# EAGLE design Serinette (EAGLE 9.5.2)
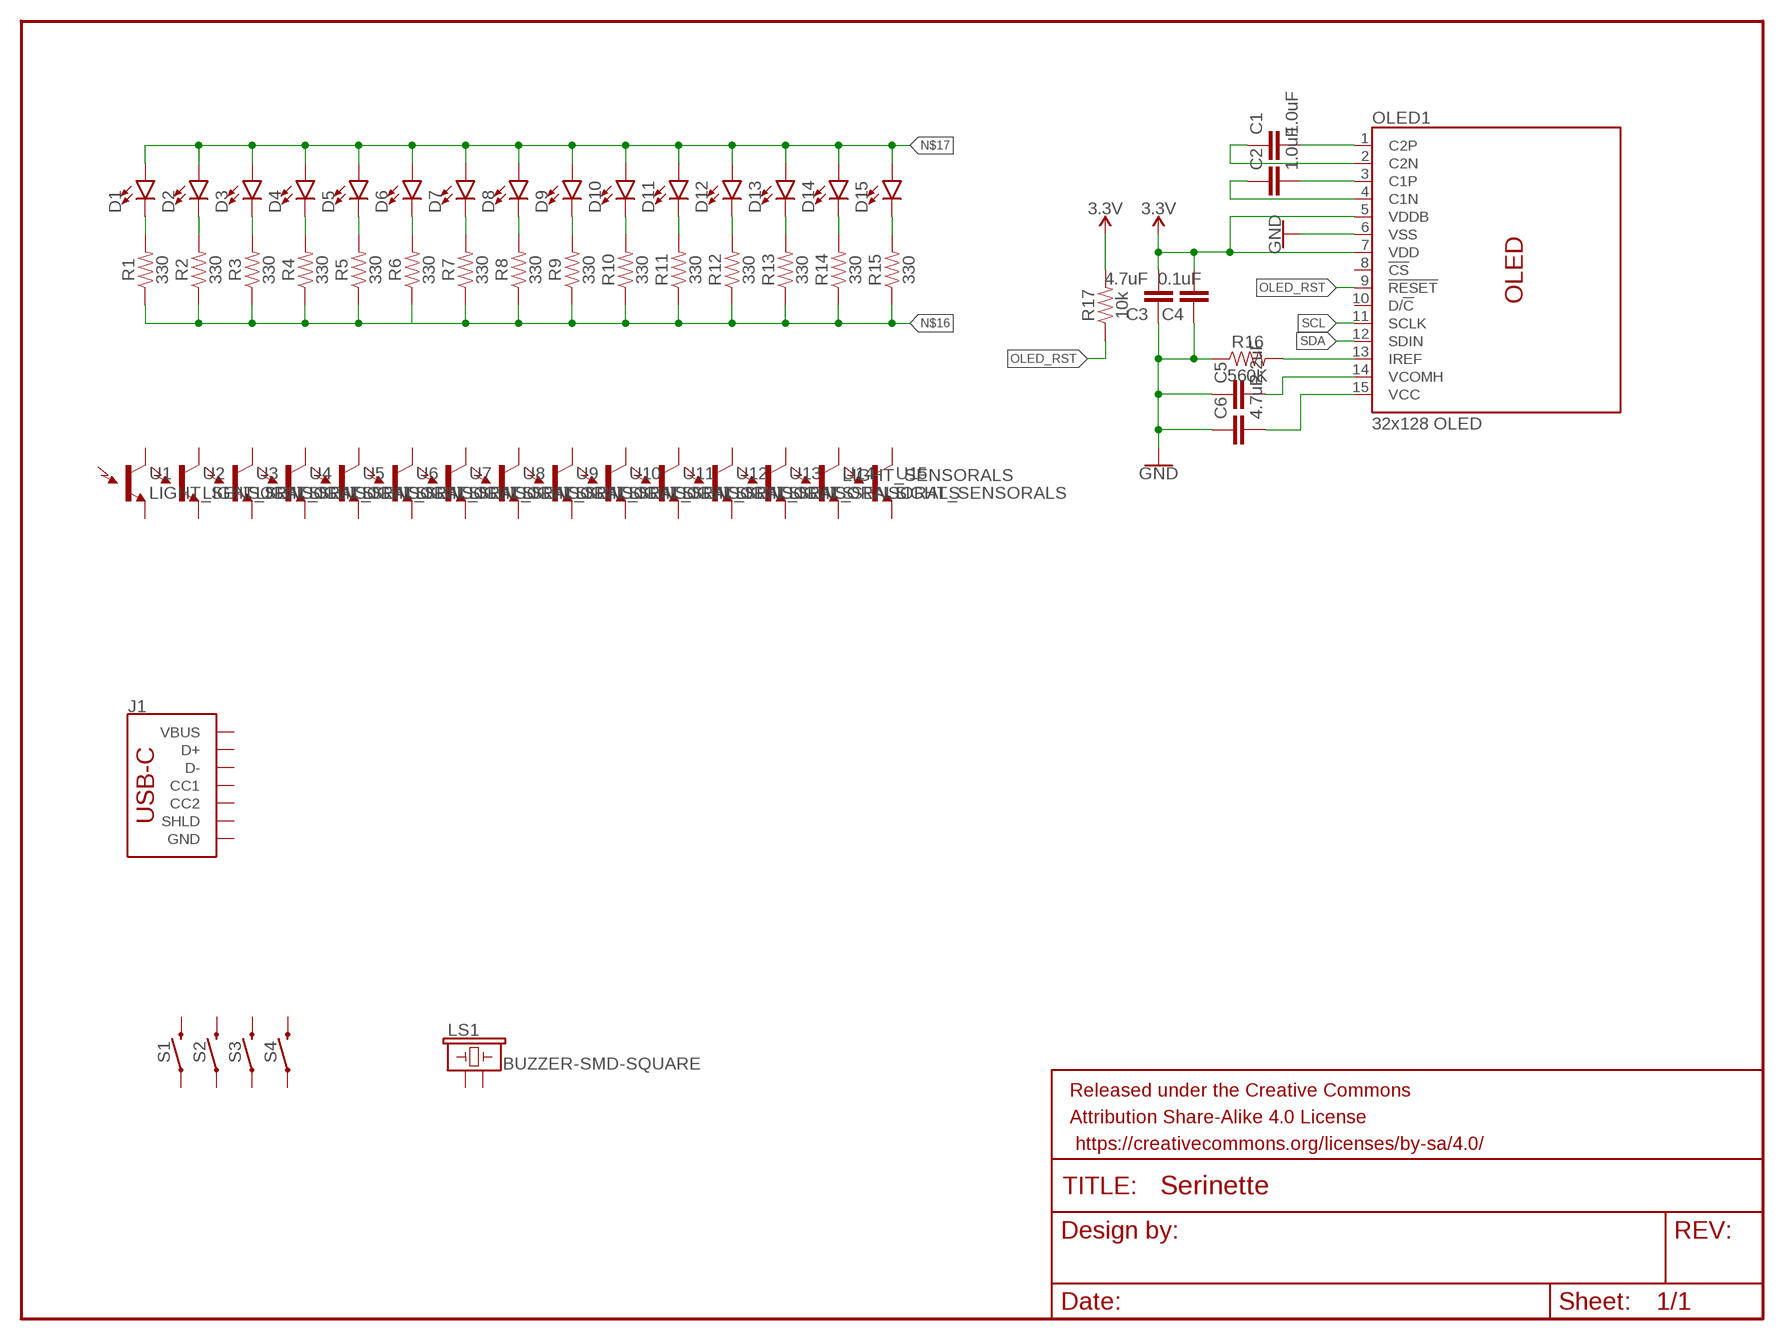
[diagram p0: schematic, sheet 1]

## Parts
C1  1.0uF  1.0UF-0603-16V-10%  [0603]
C2  1.0uF  1.0UF-0603-16V-10%  [0603]
C3  4.7uF  4.7UF-0603-35V-(20%)  [0603]
C4  0.1uF  0.1UF-0603-100V-10%  [0603]
C5  2.2uF  2.2UF-0603-10V-20%  [0603]
C6  4.7uF  4.7UF-0603-35V-(20%)  [0603]
D1  LED0603  [LED-0603]
D2  LED0603  [LED-0603]
D3  LED0603  [LED-0603]
D4  LED0603  [LED-0603]
D5  LED0603  [LED-0603]
D6  LED0603  [LED-0603]
D7  LED0603  [LED-0603]
D8  LED0603  [LED-0603]
D9  LED0603  [LED-0603]
D10  LED0603  [LED-0603]
D11  LED0603  [LED-0603]
D12  LED0603  [LED-0603]
D13  LED0603  [LED-0603]
D14  LED0603  [LED-0603]
D15  LED0603  [LED-0603]
FRAME1  FRAME-LETTER  [CREATIVE_COMMONS]
J1  USB_C_2-LAYER_PADS  [USB-C-16P-2LAYER-PADS]
LS1  BUZZER-SMD-SQUARE  [BUZZER_SMD]
OLED1  32x128 OLED  OLED128X64SIDEREAR-MOUNT  [OLED-UG-2832TSWGG01-REAR]
R1  330  330OHM-0603-1/10W-1%  [0603]
R2  330  330OHM-0603-1/10W-1%  [0603]
R3  330  330OHM-0603-1/10W-1%  [0603]
R4  330  330OHM-0603-1/10W-1%  [0603]
R5  330  330OHM-0603-1/10W-1%  [0603]
R6  330  330OHM-0603-1/10W-1%  [0603]
R7  330  330OHM-0603-1/10W-1%  [0603]
R8  330  330OHM-0603-1/10W-1%  [0603]
R9  330  330OHM-0603-1/10W-1%  [0603]
R10  330  330OHM-0603-1/10W-1%  [0603]
R11  330  330OHM-0603-1/10W-1%  [0603]
R12  330  330OHM-0603-1/10W-1%  [0603]
R13  330  330OHM-0603-1/10W-1%  [0603]
R14  330  330OHM-0603-1/10W-1%  [0603]
R15  330  330OHM-0603-1/10W-1%  [0603]
R16  560K  750KOHM-0603-1/10W-1%  [0603]
R17  10k  10KOHM-0603-1/10W-1%  [0603]
S1  MOMENTARY-SWITCH-SPST-SMD-5.2MM-TALL  [TACTILE_SWITCH_SMD_5.2MM]
S2  MOMENTARY-SWITCH-SPST-SMD-5.2MM-TALL  [TACTILE_SWITCH_SMD_5.2MM]
S3  MOMENTARY-SWITCH-SPST-SMD-5.2MM-TALL  [TACTILE_SWITCH_SMD_5.2MM]
S4  MOMENTARY-SWITCH-SPST-SMD-5.2MM-TALL  [TACTILE_SWITCH_SMD_5.2MM]
U1  LIGHT_SENSORALS  [ALS-PT19]
U2  LIGHT_SENSORALS  [ALS-PT19]
U3  LIGHT_SENSORALS  [ALS-PT19]
U4  LIGHT_SENSORALS  [ALS-PT19]
U5  LIGHT_SENSORALS  [ALS-PT19]
U6  LIGHT_SENSORALS  [ALS-PT19]
U7  LIGHT_SENSORALS  [ALS-PT19]
U8  LIGHT_SENSORALS  [ALS-PT19]
U9  LIGHT_SENSORALS  [ALS-PT19]
U10  LIGHT_SENSORALS  [ALS-PT19]
U11  LIGHT_SENSORALS  [ALS-PT19]
U12  LIGHT_SENSORALS  [ALS-PT19]
U13  LIGHT_SENSORALS  [ALS-PT19]
U14  LIGHT_SENSORALS  [ALS-PT19]
U15  LIGHT_SENSORALS  [ALS-PT19]

## Nets
3.3V: C3.2 C4.2 OLED1.5(VDDB) OLED1.7(VDD) R17.2
GND: C3.1 C4.1 C5.1 C6.1 OLED1.6(VSS) R16.1
N$1: D1.C R1.2
N$2: D2.C R2.2
N$3: D3.C R3.2
N$4: D4.C R4.2
N$5: D5.C R5.2
N$6: D6.C R6.2
N$7: D7.C R7.2
N$8: D8.C R8.2
N$9: D9.C R9.2
N$10: D10.C R10.2
N$11: D11.C R11.2
N$12: D12.C R12.2
N$13: D13.C R13.2
N$14: D14.C R14.2
N$15: D15.C R15.2
N$16: R1.1 R2.1 R3.1 R4.1 R5.1 R6.1 R7.1 R8.1 R9.1 R10.1 R11.1 R12.1 R13.1 R14.1 R15.1
N$17: D1.A D2.A D3.A D4.A D5.A D6.A D7.A D8.A D9.A D10.A D11.A D12.A D13.A D14.A D15.A
N$18: C1.2 OLED1.1(C2P)
N$19: C2.2 OLED1.3(C1P)
N$20: C1.1 OLED1.2(C2N)
N$21: C2.1 OLED1.4(C1N)
N$22: OLED1.13(IREF) R16.2
N$24: C5.2 OLED1.14(VCOMH)
N$25: C6.2 OLED1.15(VCC)
OLED_RST: OLED1.9(!RESET!) R17.1
SCL: OLED1.11(SCLK)
SDA: OLED1.12(SDIN)
Unconnected: J1.A5(CC1) J1.A6(D+) J1.A7(D-) J1.B5(CC2) J1.B6(D+) J1.B7(D-) J1.GND J1.GND2(GND) J1.SHLD1(SHLD) J1.SHLD2(SHLD) J1.SHLD3(SHLD) J1.SHLD4(SHLD) J1.VBUS1(VBUS) J1.VBUS2(VBUS) LS1.+ LS1.- OLED1.8(!CS!) OLED1.10(D/!C!) S1.1 S1.3 S2.1 S2.3 S3.1 S3.3 S4.1 S4.3 U1.C(C1) U1.E(E1) U2.C(C1) U2.E(E1) U3.C(C1) U3.E(E1) U4.C(C1) U4.E(E1) U5.C(C1) U5.E(E1) U6.C(C1) U6.E(E1) U7.C(C1) U7.E(E1) U8.C(C1) U8.E(E1) U9.C(C1) U9.E(E1) U10.C(C1) U10.E(E1) U11.C(C1) U11.E(E1) U12.C(C1) U12.E(E1) U13.C(C1) U13.E(E1) U14.C(C1) U14.E(E1) U15.C(C1) U15.E(E1)

## Library data of the parts
C1 C2 = SparkFun-Capacitors:1.0UF: 1µF ceramic capacitors A capacitor is a passive two-terminal electrical component used to store electrical energy temporarily in an electric field.; PROD_ID: CAP-00868
C3 C6 = SparkFun-Capacitors:4.7UF: 4.7µF ceramic capacitors A capacitor is a passive two-terminal electrical component used to store electrical energy temporarily in an electric field.; PROD_ID: CAP-14106
C4 = SparkFun-Capacitors:0.1UF: 0.1µF ceramic capacitors A capacitor is a passive two-terminal electrical component used to store electrical energy temporarily in an electric field.; PROD_ID: CAP-08390
C5 = SparkFun-Capacitors:2.2UF: 2.2µF ceramic capacitors A capacitor is a passive two-terminal electrical component used to store electrical energy temporarily in an electric field.; PROD_ID: CAP-07888
D1-D15 = SparkFun-LED:LED: LED (Generic) Standard schematic elements and footprints for 5mm, 3mm, 1206, and 0603 sized LEDs. Generic LEDs with no color specified.
FRAME1 = SparkFun-Aesthetics:FRAME-LETTER: Schematic Frame - Letter Standard 8.5x11 US Letter frame
J1 = SparkFun-Connectors:USB_C: USB Type C 16Pin Connector Super Speed pins not available on the 16-pin purely SMD connector so this part is best for USB 2.0 implementations. D1 and D2 are tied together enabling D+/- no matter which way the cable is plugged into the connector. The two channel configuration pins (CC1/2) are exposed. These are normally connected to ground via 5.1k resistors but can be reconfigured for high current/high power applications. **4-LAYER BOARD WARNING!!** If designing 4-layer board, make sure to select the variant _4-LAYER-ISOLATED. The linked footprint (USB-C-16-4LAYER-ISOLATED) includes some very necessary cutout polygons in the inner layers (2 and 15). This prevents the PTH mounting shield legs on the USB connector from electrically connecting any other polygons on the inner layers (usually VCC and GND).; PROD_ID: CONN-14122
LS1 = SparkFun-Electromechanical:BUZZER: Buzzer Small round buzzers that operate around the audible 2kHz range. You can use these as speakers to create simple music or user interfaces. Variant Overview: PTH - Mini Speaker - PC Mount 12mm 2.048kHz <https://www.sparkfun.com/products/7950> PTH_KIT - Mini Speaker - PC Mount 12mm 2.048kHz <https://www.sparkfun.com/products/7950> KIT simplifies soldering by adding stop mask to one side of the pads. PTH_NO_SILK - Mini Speaker - PC Mount 12mm 2.048kHz <https://www.sparkfun.com/products/7950> No silkscreen indicator of buzzer outline. PTH_KIT_NO_SILK - Mini Speaker - PC Mount 12mm 2.048kHz <https://www.sparkfun.com/products/7950> KIT package w/o silkscreen SMD - Buzzer Audio Magnetic (CCV-084B16) SMD buzzer used on, e.g. the LilyPad Buzzer <https://www.sparkfun.com/products/8463> and RFID USB Reader <https://www.sparkfun.com/products/9963>. SMD_KIT - Buzzer Audio Magnetic (CCV-084B16) SMD Buzzer with elongated pins to make soldering easier. Used on the SparkFun Simon Says - Surface Mount Soldering Kit <https://www.sparkfun.com/products/10935>. SMD-SQUARE - Buzzer Audio Magnetic (COMP-15701) SMT square buzzer with one chamfered corner.; PROD_ID: COMP-15701
OLED1 = SparkFun-Displays:OLED128X64SIDE: Micro OLED TODO: Add description SparkFun Products: Product <https://www.sparkfun.com/products/13003>; PROD_ID: LCD-13577
R1-R15 = SparkFun-Resistors:330OHM: 330Ω resistor A resistor is a passive two-terminal electrical component that implements electrical resistance as a circuit element. Resistors act to reduce current flow, and, at the same time, act to lower voltage levels within circuits. - Wikipedia; PROD_ID: RES-00818
R16 = SparkFun-Resistors:750KOHM: 750Ω resistor A resistor is a passive two-terminal electrical component that implements electrical resistance as a circuit element. Resistors act to reduce current flow, and, at the same time, act to lower voltage levels within circuits. - Wikipedia; PROD_ID: RES-13768; VALUE: 750K
R17 = SparkFun-Resistors:10KOHM: 10kΩ resistor A resistor is a passive two-terminal electrical component that implements electrical resistance as a circuit element. Resistors act to reduce current flow, and, at the same time, act to lower voltage levels within circuits. - Wikipedia; PROD_ID: RES-00824
S1-S4 = SparkFun-Switches:MOMENTARY-SWITCH-SPST: Momentary Switch (Pushbutton) - SPST Normally-open (NO) SPST momentary switches (buttons, pushbuttons). Variants PTH-12MM - 12mm square, through-hole Momentary Pushbutton Switch - 12mm Square <https://www.sparkfun.com/products/9190> (COM-09190) PTH-6.0MM, PTH-6.0MM-KIT - 6.0mm square, through-hole Mini Pushbutton Switch <https://www.sparkfun.com/products/97> (COM-00097) KIT package intended for soldering kit's - only one side of pads' copper is exposed. PTH-RIGHT-ANGLE-KIT - Right-angle, through-hole Right Angle Tactile Button <https://www.sparkfun.com/products/10791> - Used on SparkFun BigTime Watch Kit <https://www.sparkfun.com/products/11734> SMD-12MM - 12mm square, surface-mount Tactile Button - SMD (12mm) <https://www.sparkfun.com/products/12993> (COM-12993) Used on SparkFun PicoBoard <https://www.sparkfun.com/products/11888> SMD-4.5MM - 4.5mm Square Trackball Switch Used on SparkFun Blackberry Trackballer Breakout <https://www.sparkfun.com/products/13169> SMD-4.6MMX2.8MM - 4.60mm x 2.80mm, surface mount Used on SparkFun Pro Micro - RP2040 <https://www.sparkfun.com/products/17717> SMD-5.2MM, SMD-5.2-REDUNDANT - 5.2mm square, surface-mount Mini Pushbutton Switch - SMD <https://www.sparkfun.com/products/8720> (COM-08720) Used on Arduino Pro Mini <https://www.sparkfun.com/products/11114> REDUNDANT package connects both switch circuits together SMD-6.0X3.5MM - 6.0 x 3.5mm, surface mount Momentary Reset Switch SMD <https://www.sparkfun.com/products/8229> (COM-08229) SMD-6.2MM-TALL - 6.2mm square, surface mount Tactile Button - SMD (6mm) <https://www.sparkfun.com/products/12992> Used on SparkFun Digital Sandbox <https://www.sparkfun.com/products/12651> SMD-RIGHT-ANGLE - Right-angle, surface mount Used on SparkFun Block for Intel® Edison - Arduino <https://www.sparkfun.com/products/13036>; PROD_ID: SWCH-14139
U1-U15 = SparkFun-Sensors:LIGHT_SENSOR: Ambient Light Sensors - Phototransistors Low cost ambient light sensors, consisting of a phototransistor in miniature SMD packages. Output voltage varies with light intensity. SparkFun Products ALS-PT19 Light Sensor <https://www.sparkfun.com/products/12566> (SEN-12566) Ambient Light Sensor - TEMT6000 <https://www.sparkfun.com/products/8348> (SEN-08348) SparkFun Ambient Light Sensor Breakout - TEMT60000 <https://www.sparkfun.com/products/8688> (SEN-08688); PROD_ID: IC-11836; SF_ID: SEN-12566

## Board
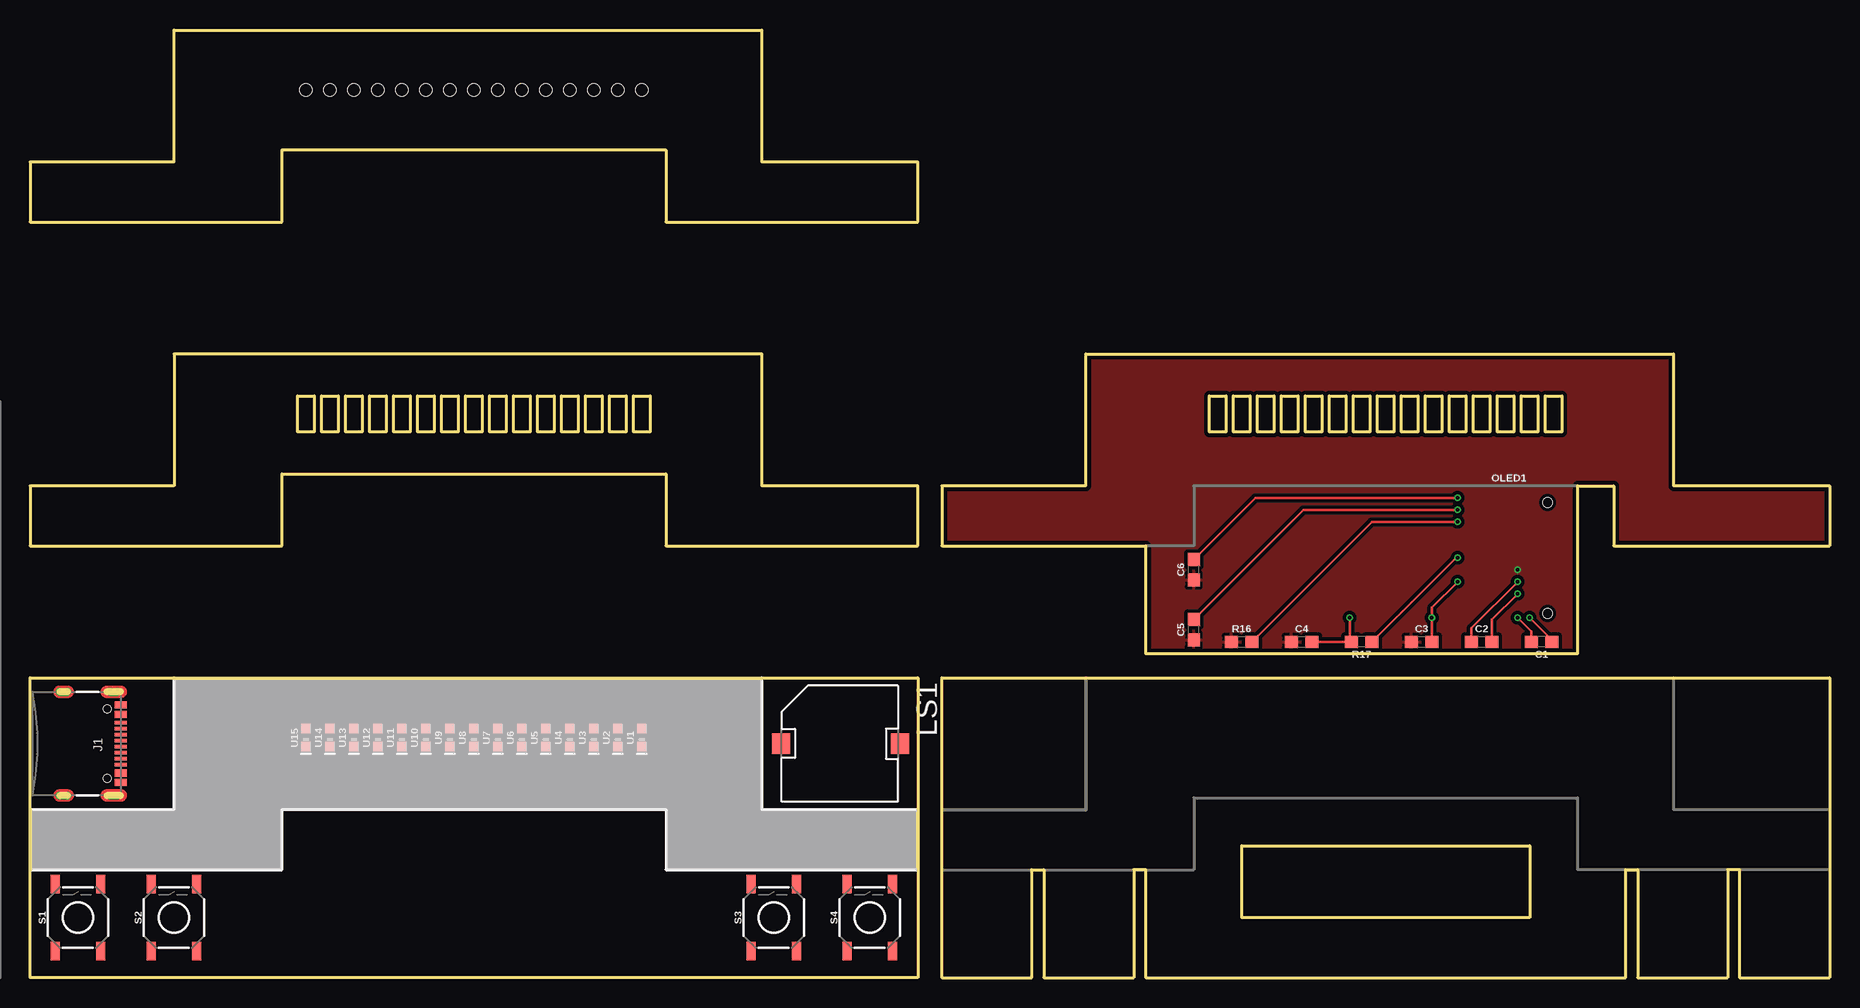
[diagram p1: board, top side]
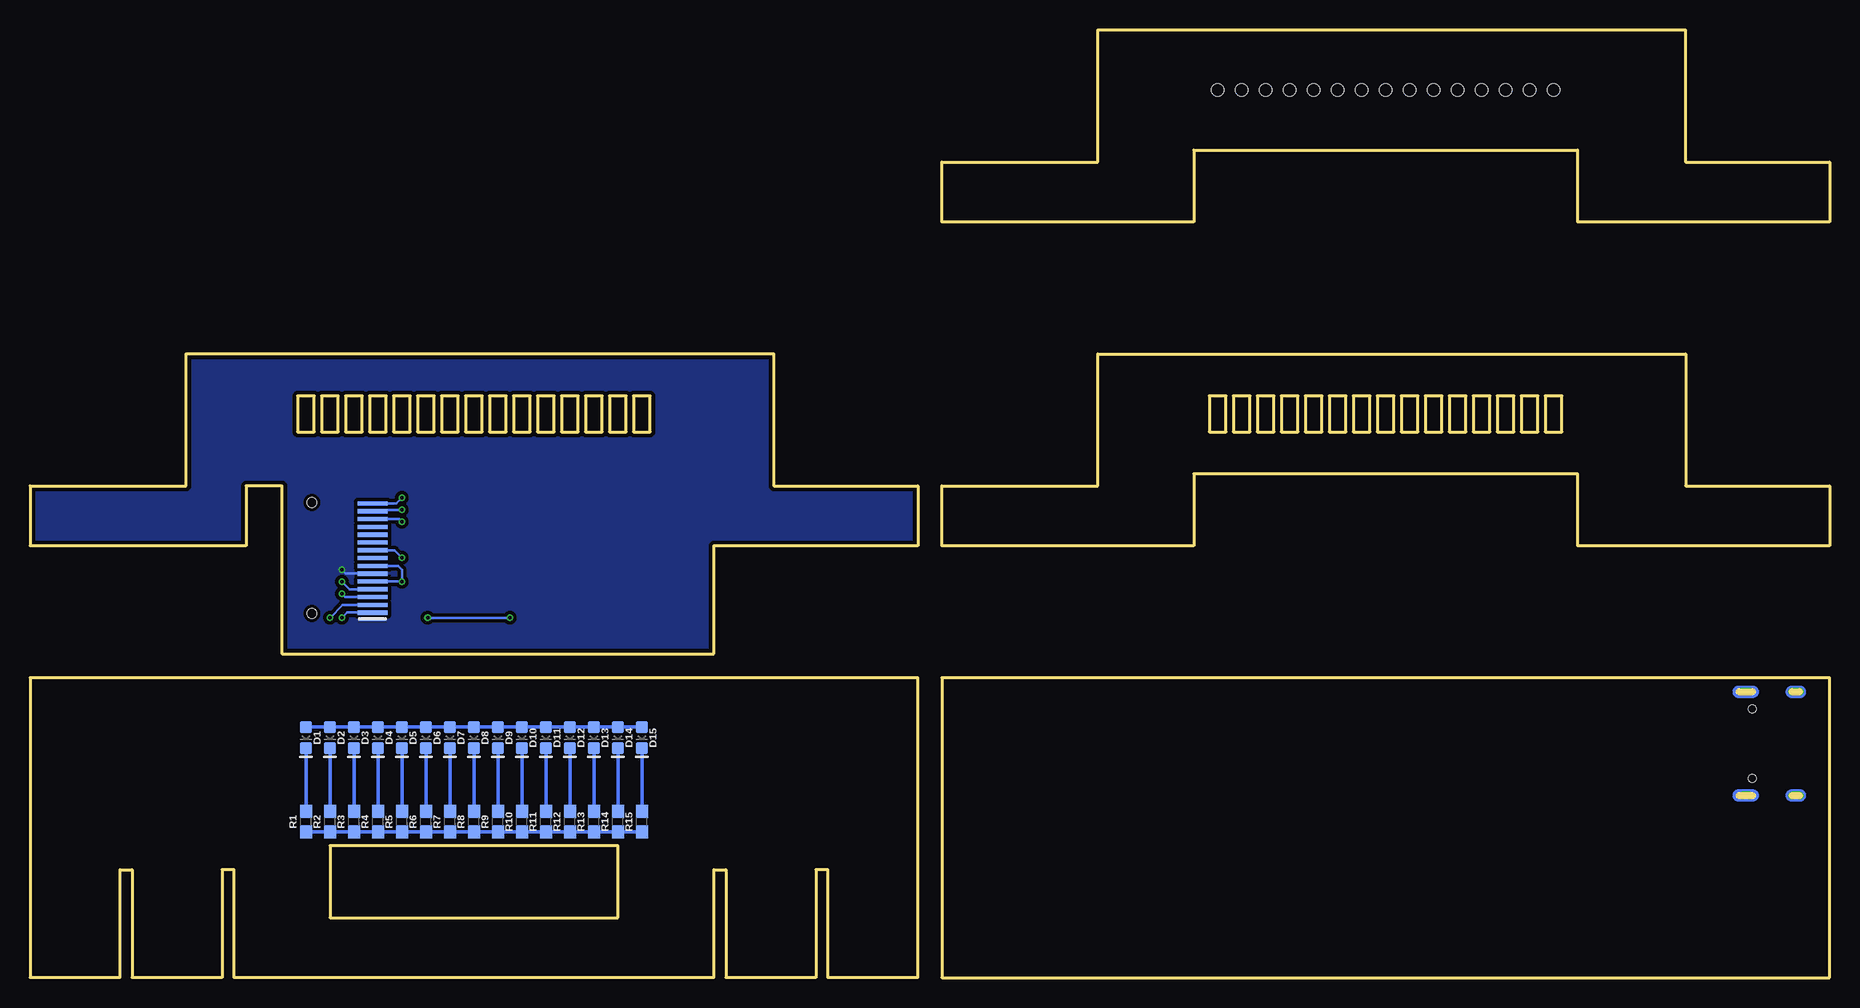
[diagram p2: board, bottom side, seen from below]

Size 150 x 79 mm. Coordinates in mm from the lower left corner, seen from the top.
Outline: 0,0 0,25 74,25 74,0 0,0
Outline: 12,68 12,79 61,79 61,68 74,68 74,63 53,63 53,69 21,69 21,63 0,63 0,68 12,68
Outline: 22.3,45.5 22.3,48.5 23.7,48.5 23.7,45.5 22.3,45.5
Outline: 24.3,45.5 24.3,48.5 25.7,48.5 25.7,45.5 24.3,45.5
Outline: 26.3,45.5 26.3,48.5 27.7,48.5 27.7,45.5 26.3,45.5
Outline: 28.3,45.5 28.3,48.5 29.7,48.5 29.7,45.5 28.3,45.5
Outline: 30.3,45.5 30.3,48.5 31.7,48.5 31.7,45.5 30.3,45.5
Outline: 32.3,45.5 32.3,48.5 33.7,48.5 33.7,45.5 32.3,45.5
Outline: 34.3,45.5 34.3,48.5 35.7,48.5 35.7,45.5 34.3,45.5
Outline: 36.3,45.5 36.3,48.5 37.7,48.5 37.7,45.5 36.3,45.5
Outline: 38.3,45.5 38.3,48.5 39.7,48.5 39.7,45.5 38.3,45.5
Outline: 40.3,45.5 40.3,48.5 41.7,48.5 41.7,45.5 40.3,45.5
Outline: 42.3,45.5 42.3,48.5 43.7,48.5 43.7,45.5 42.3,45.5
Outline: 44.3,45.5 44.3,48.5 45.7,48.5 45.7,45.5 44.3,45.5
Outline: 46.3,45.5 46.3,48.5 47.7,48.5 47.7,45.5 46.3,45.5
Outline: 48.3,45.5 48.3,48.5 49.7,48.5 49.7,45.5 48.3,45.5
Outline: 50.3,45.5 50.3,48.5 51.7,48.5 51.7,45.5 50.3,45.5
Outline: 88,41 88,52 137,52 137,41 150,41 150,36 132,36 132,41 129,41 129,27 93,27 93,36 76,36 76,41 88,41
Outline: 98.3,45.5 98.3,48.5 99.7,48.5 99.7,45.5 98.3,45.5
Outline: 100.3,45.5 100.3,48.5 101.7,48.5 101.7,45.5 100.3,45.5
Outline: 102.3,45.5 102.3,48.5 103.7,48.5 103.7,45.5 102.3,45.5
Outline: 104.3,45.5 104.3,48.5 105.7,48.5 105.7,45.5 104.3,45.5
Outline: 106.3,45.5 106.3,48.5 107.7,48.5 107.7,45.5 106.3,45.5
Outline: 108.3,45.5 108.3,48.5 109.7,48.5 109.7,45.5 108.3,45.5
Outline: 110.3,45.5 110.3,48.5 111.7,48.5 111.7,45.5 110.3,45.5
Outline: 112.3,45.5 112.3,48.5 113.7,48.5 113.7,45.5 112.3,45.5
Outline: 114.3,45.5 114.3,48.5 115.7,48.5 115.7,45.5 114.3,45.5
Outline: 116.3,45.5 116.3,48.5 117.7,48.5 117.7,45.5 116.3,45.5
Outline: 118.3,45.5 118.3,48.5 119.7,48.5 119.7,45.5 118.3,45.5
Outline: 120.3,45.5 120.3,48.5 121.7,48.5 121.7,45.5 120.3,45.5
Outline: 122.3,45.5 122.3,48.5 123.7,48.5 123.7,45.5 122.3,45.5
Outline: 124.3,45.5 124.3,48.5 125.7,48.5 125.7,45.5 124.3,45.5
Outline: 126.3,45.5 126.3,48.5 127.7,48.5 127.7,45.5 126.3,45.5
Outline: 76,0 76,25 150,25 150,0 142.5,0 142.5,9 141.5,9 141.5,0 134,0 134,9 133,9 133,0 93,0 93,9 92,9 92,0 84.5,0 84.5,9 83.5,9 83.5,0 76,0
Outline: 101,5 101,11 125,11 125,5 101,5
Outline: 12,52 12,41 0,41 0,36 21,36 21,42 53,42 53,36 74,36 74,41 61,41 61,52 12,52
Copper layers (1*16): Top 0.035mm / dielectric 1.5mm / Bottom 0.035mm
Design rules "SparkFun-2-Layer-Minimum-JLCPCB": minimum track width 5mil, minimum drill 0.3mm, track to track 5mil, track to pad 5mil, pad to pad 5mil, via to via 5mil, smd to smd 5mil, copper to edge 7mil, drill to drill 7mil, minimum pad ring 5mil, minimum via ring 5mil, stop-mask expansion 4mil, vias tented up to drill 25mil, thermal gap 10mil
Holes 1 mm at 23,74 25,74 27,74 29,74 31,74 33,74 35,74 37,74 39,74 41,74 43,74 45,74 47,74 49,74 51,74

### Footprints (pad centres in the part's own frame; a part is rotated, then mirrored left to right if it is on the bottom)
0603 = smd 1.1 x 1: 1 -0.85,0; 2 0.85,0
LED-0603 = smd 1 x 1: A -0.877,0; C 0.877,0
USB-C-16P-2LAYER-PADS = smd 0.3 x 1: A5 -1.25,-0.34; A6 -0.25,-0.34; A7 0.25,-0.34; A8 1.25,-0.34; B5 1.75,-0.34; B6 0.75,-0.34; B7 -0.75,-0.34; B8 -1.75,-0.34 | smd 0.6 x 1: GND -3.225,-0.34; GND2 3.225,-0.34; VBUS1 -2.45,-0.34; VBUS2 2.45,-0.34 | drill 0.4 pad 0.6 long: SHLD1 -4.318,-0.915; SHLD2 4.318,-0.915; SHLD3 -4.318,-5.095; SHLD4 4.318,-5.095 | hole 0.65: -2.89,-1.445; 2.89,-1.445
BUZZER_SMD = smd 1.7 x 1.5: + 0,5; - 0,-4.9
OLED-UG-2832TSWGG01-REAR = smd 2.5 x 0.35 bottom: 1 0.75,-10.175; 2 0.75,-9.525; 3 0.75,-8.875; 4 0.75,-8.225; 5 0.75,-7.575; 6 0.75,-6.925; 7 0.75,-6.275; 8 0.75,-5.625; 9 0.75,-4.975; 10 0.75,-4.325; 11 0.75,-3.675; 12 0.75,-3.025; 13 0.75,-2.375; 14 0.75,-1.725; 15 0.75,-1.075 | hole 0.8: 5.8,-1; 5.8,-10.25
TACTILE_SWITCH_SMD_5.2MM = smd 1.524 x 0.762: 1 -2.794,1.905; 2 2.794,1.905; 3 -2.794,-1.905; 4 2.794,-1.905
ALS-PT19 = smd 0.8 x 0.8: C -0.75,0; E 0.75,0

### Placement (x,y rotation side)
C1  126,28 180 top
C2  121,28 0 top
C3  116,28 0 top
C4  106,28 0 top
C5  97,29 90 top
C6  97,34 90 top
D1  127,20 270 bottom
D2  125,20 270 bottom
D3  123,20 270 bottom
D4  121,20 270 bottom
D5  119,20 270 bottom
D6  117,20 270 bottom
D7  115,20 270 bottom
D8  113,20 270 bottom
D9  111,20 270 bottom
D10  109,20 270 bottom
D11  107,20 270 bottom
D12  105,20 270 bottom
D13  103,20 270 bottom
D14  101,20 270 bottom
D15  99,20 270 bottom
E$1  [KIKKERLAND15]  -23,0 0 top  (outside the outline)
FRAME1  26,-12 0 top  (outside the outline)
J1  7.9,19.5 270 top
LS1  67.5,19.5 270 top
OLED1  120.7,40.6 0 top
R1  127,13 90 bottom
R2  125,13 90 bottom
R3  123,13 90 bottom
R4  121,13 90 bottom
R5  119,13 90 bottom
R6  117,13 90 bottom
R7  115,13 90 bottom
R8  113,13 90 bottom
R9  111,13 90 bottom
R10  109,13 90 bottom
R11  107,13 90 bottom
R12  105,13 90 bottom
R13  103,13 90 bottom
R14  101,13 90 bottom
R15  99,13 90 bottom
R16  101,28 0 top
R17  111,28 180 top
S1  4,5 90 top
S2  12,5 90 top
S3  62,5 90 top
S4  70,5 90 top
U1  51,20 90 top
U2  49,20 90 top
U3  47,20 90 top
U4  45,20 90 top
U5  43,20 90 top
U6  41,20 90 top
U7  39,20 90 top
U8  37,20 90 top
U9  35,20 90 top
U10  33,20 90 top
U11  31,20 90 top
U12  29,20 90 top
U13  27,20 90 top
U14  25,20 90 top
U15  23,20 90 top

### Tracks (layer width: path | path; a pad name or v marks a point on that pad's centre or on a via)
3.3V  (via drill 0.3)
  Top 0.2: C3.2 v116.85,30 116.85,30.85 v119,33 | v110,30 110,28.15 R17.2 C4.2
  Bottom 0.2: OLED1.5 119.03,33.02 v119,33 119,34 119.33,34.33 OLED1.7 | v110,30 v116.85,30
GND  (via drill 0.3)
  Bottom 0.2: OLED1.6 123.67,33.67 v124,34
  pour Bottom (isolate 0.305): 76,36 76,41 88,41 88,52 137,52 137,41 150,41 150,36 132,36 132,41 129,41 129,27 93,27 93,36
  pour Top (isolate 0.305): 76,36 76,41 88,41 88,52 137,52 137,41 150,41 150,36 132,36 132,41 129,41 129,27 93,27 93,36
N$1
  Bottom 0.3: D1.C R1.2
N$2
  Bottom 0.3: D2.C R2.2
N$3
  Bottom 0.3: D3.C R3.2
N$4
  Bottom 0.3: D4.C R4.2
N$5
  Bottom 0.3: D5.C R5.2
N$6
  Bottom 0.3: D6.C R6.2
N$7
  Bottom 0.3: D7.C R7.2
N$8
  Bottom 0.3: D8.C R8.2
N$9
  Bottom 0.3: D9.C R9.2
N$10
  Bottom 0.3: D10.C R10.2
N$11
  Bottom 0.3: D11.C R11.2
N$12
  Bottom 0.3: D12.C R12.2
N$13
  Bottom 0.3: D13.C R13.2
N$14
  Bottom 0.3: D14.C R14.2
N$15
  Bottom 0.3: D15.C R15.2
N$16
  Bottom 0.3: R1.1 R2.1 R3.1 R4.1 R5.1 R6.1 R7.1 R8.1 R9.1 R10.1 R11.1 R12.1 R13.1 R14.1 R15.1
N$17
  Bottom 0.3: D1.A D2.A D3.A D4.A D5.A D6.A D7.A D8.A D9.A D10.A D11.A D12.A D13.A D14.A D15.A
N$18  (via drill 0.3)
  Top 0.2: v124,30 125.15,28.85 C1.2
  Bottom 0.2: OLED1.1 123.58,30.43 v124,30
N$19  (via drill 0.3)
  Top 0.2: v124,32 121.85,29.85 C2.2
  Bottom 0.2: OLED1.3 123.72,31.73 v124,32
N$20  (via drill 0.3)
  Top 0.2: v125,30 126.85,28.15 C1.1
  Bottom 0.2: OLED1.2 123.92,31.07 v125,30
N$21  (via drill 0.3)
  Top 0.2: v124,33 120.15,29.15 C2.1
  Bottom 0.2: OLED1.4 123.38,32.38 v124,33
N$22  (via drill 0.3)
  Top 0.2: R16.2 111.85,38 v119,38
  Bottom 0.2: v119,38 119.22,38.23 OLED1.13
N$24  (via drill 0.3)
  Top 0.2: C5.2 106.15,39 v119,39
  Bottom 0.2: v119,39 121.33,39 OLED1.14
N$25  (via drill 0.3)
  Top 0.2: C6.2 102.15,40 v119,40
  Bottom 0.2: v119,40 119.47,39.52 OLED1.15
OLED_RST  (via drill 0.3)
  Top 0.2: R17.1 118.85,35 v119,35
  Bottom 0.2: v119,35 119.62,35.62 OLED1.9

### Text on the board
tDocu: X2 1.6mm | X2 1.6mm | NPoole